# EAGLE design Color-lcd-backpack-v1.1 (EAGLE 5.10)
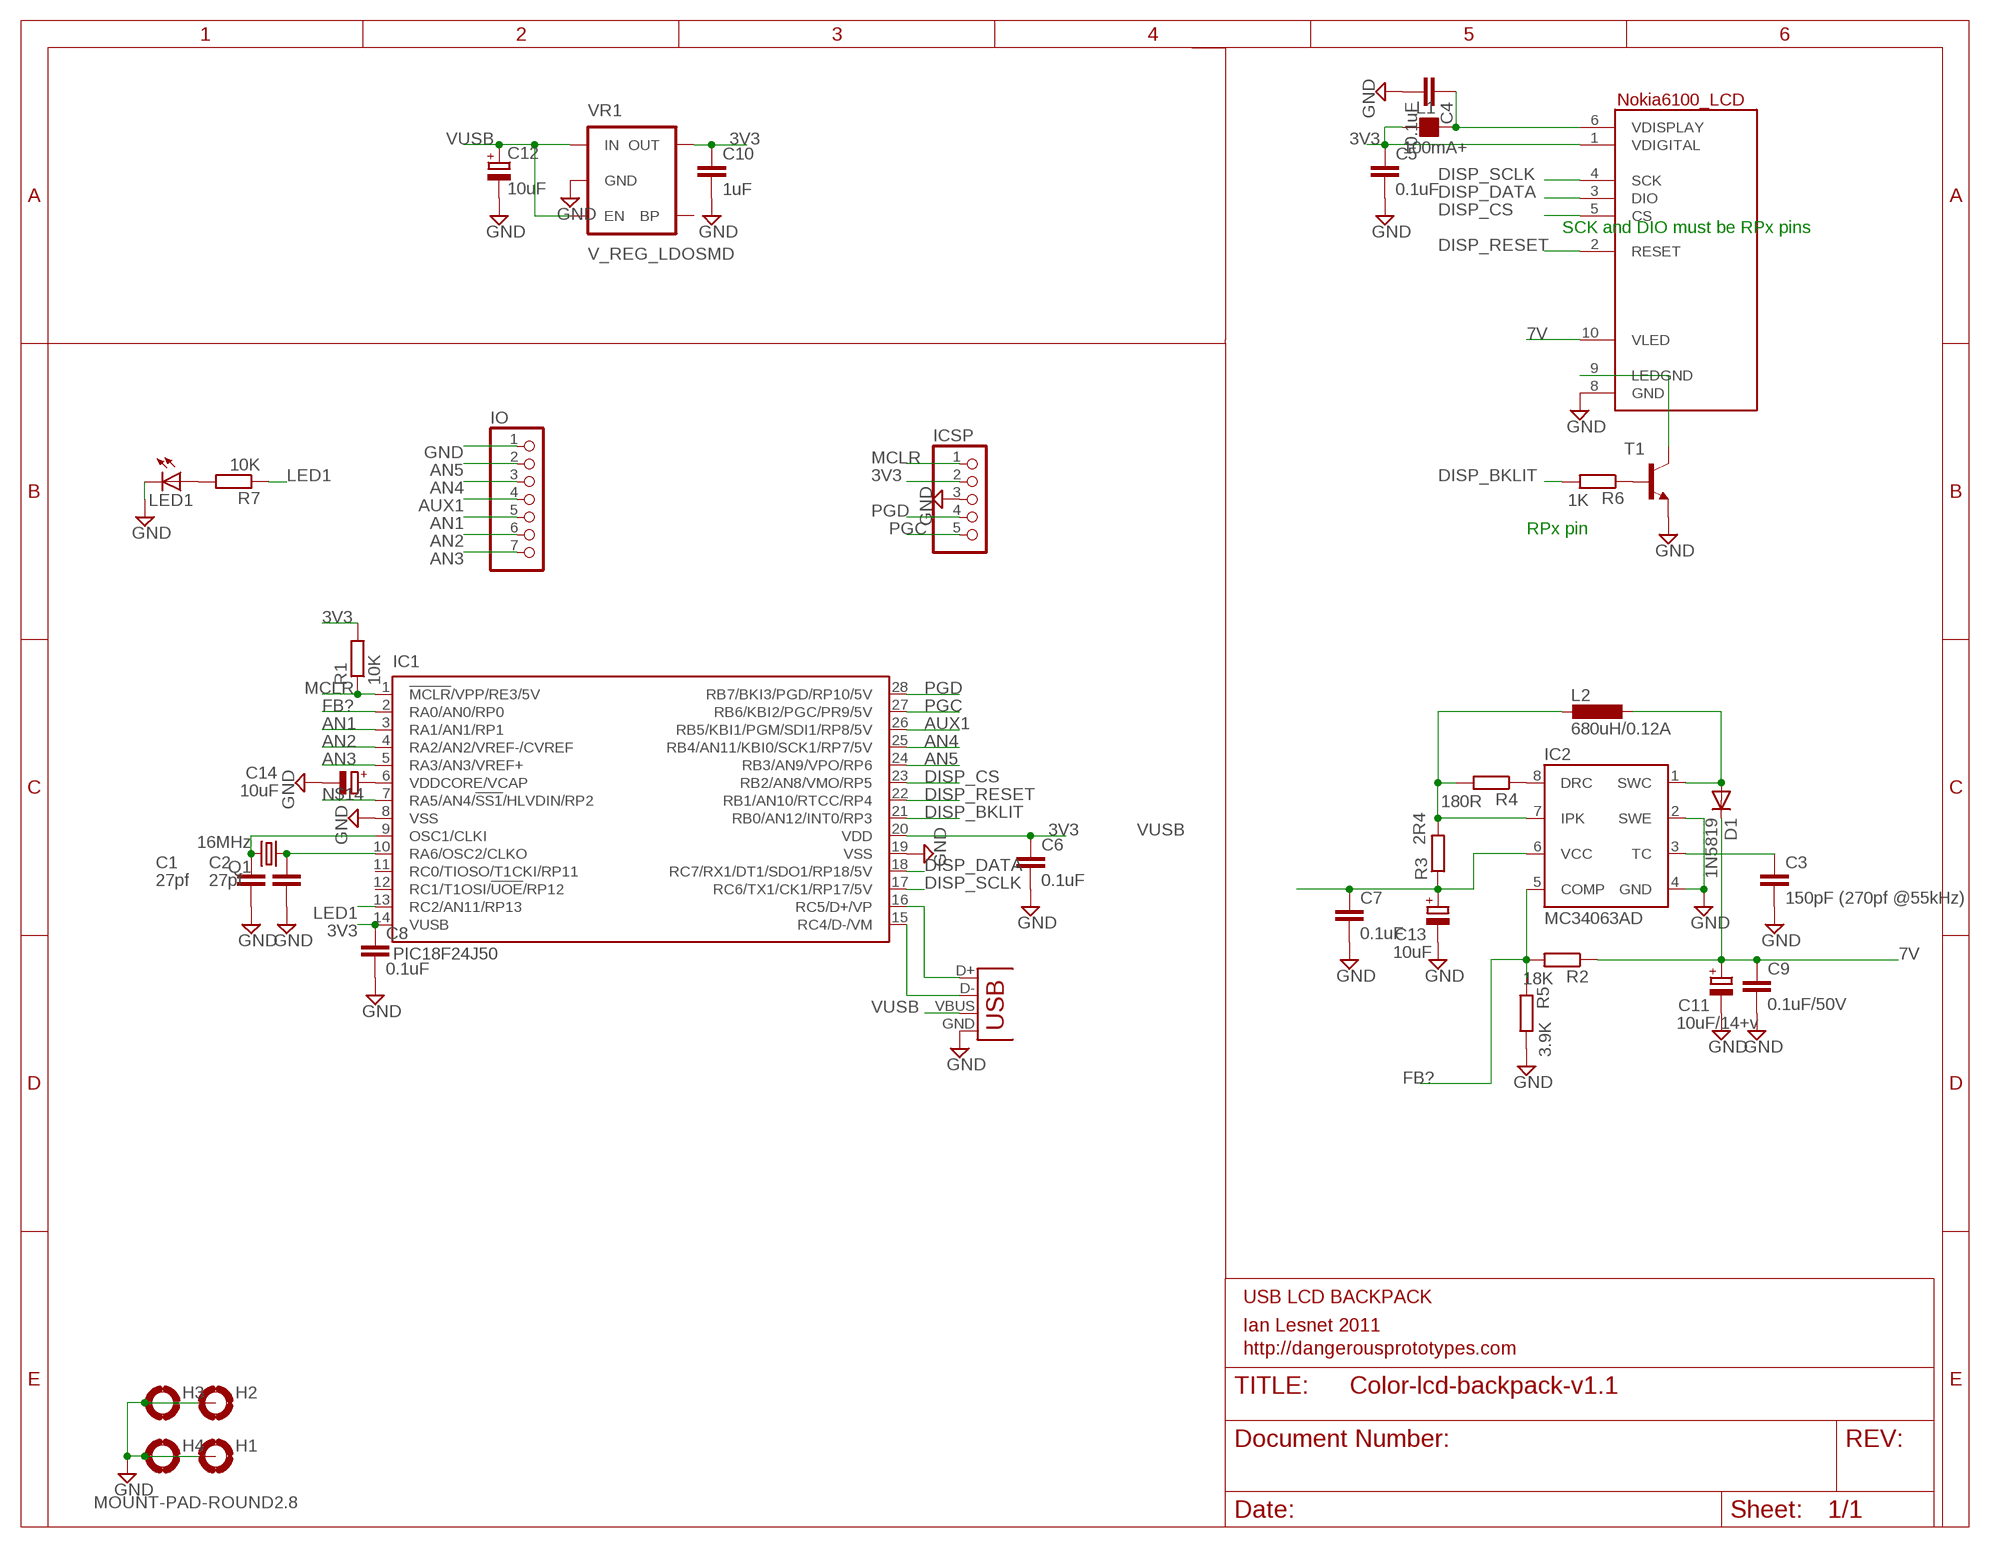
[diagram p0: schematic, sheet 1]

## Parts
C1  27pf  C-EUC0805  [C0805]
C2  27pf  C-EUC0805  [C0805]
C3  150pF (270pf @55kHz)  C-EUC0805K  [C0805K]
C4  0.1uF  C-EUC0805  [C0805]
C5  0.1uF  C-EUC0805  [C0805]
C6  0.1uF  C-EUC0805  [C0805]
C7  0.1uF  C-EUC0805K  [C0805K]
C8  0.1uF  C-EUC0805  [C0805]
C9  0.1uF/50V  C-EUC0805K  [C0805K]
C10  1uF  C-EUC0805  [C0805]
C11  10uF/14+v  CPOL-EUSANYO_SMD_A5  [SANYO-OSCON_SMD_A5]
C12  10uF  CPOL-EUSMCA  [SMC_A]
C13  10uF  CPOL-EUSMCA  [SMC_A]
C14  10uF  CPOL-EUSMCA  [SMC_A]
D1  1N5819  MBR0520LT  [SOD123]
H1  MOUNT-PAD-ROUND2.8  [2,8-PAD]
H2  MOUNT-PAD-ROUND2.8  [2,8-PAD]
H3  MOUNT-PAD-ROUND2.8  [2,8-PAD]
H4  MOUNT-PAD-ROUND2.8  [2,8-PAD]
IC1  PIC18F24J50  PIC18FJ2X50SSOP  [SSOP28]
IC2  MC34063AD  [SO08]
ICSP  PINHD-1X5  [1X05]
IO  PINHD-1X07_2.54-S  [1X07-S]
L1  100mA+  FB_0805  [L0805]
L2  680uH/0.12A  L-EUL4532P  [L4532P]
LCD1  NOKIA6100_LCD  [NOKIA6100_LCD]
LED1  LEDCHIPLED_0805  [CHIPLED_0805]
Q1  16MHz  CRYSTALHC49UP  [HC49UP]
R1  10K  R-EU_M0805  [M0805]
R2  18K  R-EU_M0805  [M0805]
R3  2R4  R-EU_M0805  [M0805]
R4  180R  R-EU_M0805  [M0805]
R5  3.9K  R-EU_M0805  [M0805]
R6  1K  R-EU_M0805  [M0805]
R7  10K  R-EU_M0805  [M0805]
T1  NPNSOT23BEC  [SOT23-BEC]
USB  USBSMD  [USB-MINIB]
VR1  V_REG_LDOSMD  [SOT23-5]

## Nets
3V3: C5.1 C6.1 C8.1 C10.1 IC1.14(VUSB) IC1.20(VDD) ICSP.2 L1.1 LCD1.1(VDIGITAL) R1.2 VR1.5(OUT)
7V: C9.1 C11.+ D1.C LCD1.10(VLED) R2.1
AN1: IC1.3(RA1/AN1/RP1) IO.5
AN2: IC1.4(RA2/AN2/VREF-/CVREF) IO.6
AN3: IC1.5(RA3/AN3/VREF+) IO.7
AN4: IC1.25(RB4/AN11/KBI0/SCK1/RP7/5V) IO.3
AN5: IC1.24(RB3/AN9/VPO/RP6) IO.2
AUX1: IC1.26(RB5/KBI1/PGM/SDI1/RP8/5V) IO.4
DISP_BKLIT: IC1.21(RB0/AN12/INT0/RP3) R6.2
DISP_CS: IC1.23(RB2/AN8/VMO/RP5) LCD1.5(CS)
DISP_DATA: IC1.18(RC7/RX1/DT1/SDO1/RP18/5V) LCD1.3(DIO)
DISP_RESET: IC1.22(RB1/AN10/RTCC/RP4) LCD1.2(RESET)
DISP_SCLK: IC1.17(RC6/TX1/CK1/RP17/5V) LCD1.4(SCK)
FB?: IC1.2(RA0/AN0/RP0) IC2.5(COMP) R2.2 R5.1
GND: C1.2 C2.2 C3.2 C4.2 C5.2 C6.2 C7.2 C8.2 C9.2 C10.2 C11.- C12.- C13.- C14.- H1.B2,8(MOUNT) H2.B2,8(MOUNT) H3.B2,8(MOUNT) H4.B2,8(MOUNT) IC1.8(VSS) IC1.19(VSS) IC2.2(SWE) IC2.4(GND) ICSP.3 IO.1 LCD1.8(GND) LED1.C R5.2 T1.E USB.GND VR1.2(GND)
LED1: IC1.13(RC2/AN11/RP13) R7.1
MCLR: IC1.1(!MCLR!/VPP/RE3/5V) ICSP.1 R1.1
N$1: LCD1.9(LEDGND) T1.C
N$2: C4.1 L1.2 LCD1.6(VDISPLAY)
N$3: R6.1 T1.B
N$4: C1.1 IC1.9(OSC1/CLKI) Q1.2
N$5: C2.1 IC1.10(RA6/OSC2/CLKO) Q1.1
N$6: C14.+ IC1.6(VDDCORE/VCAP)
N$7: IC1.16(RC5/D+/VP) USB.D+
N$8: IC1.15(RC4/D-/VM) USB.D-
N$9: IC2.8(DRC) R4.1
N$10: LED1.A R7.2
N$11: IC2.7(IPK) L2.2 R3.2 R4.2
N$14: IC1.7(RA5/AN4/!SS1!/HLVDIN/RP2)
N$17: D1.A IC2.1(SWC) L2.1
N$19: C3.1 IC2.3(TC)
PGC: IC1.27(RB6/KBI2/PGC/PR9/5V) ICSP.5
PGD: IC1.28(RB7/BKI3/PGD/RP10/5V) ICSP.4
VUSB: C7.1 C12.+ C13.+ IC2.6(VCC) R3.1 USB.VBUS VR1.1(IN) VR1.3(EN)
Unconnected: IC1.11(RC0/TIOSO/T1CKI/RP11) IC1.12(RC1/T1OSI/!UOE!/RP12) VR1.4(BP)

## Notes on the sheet
- SCK and DIO must be RPx pins
- RPx pin
- USB LCD BACKPACK
- Ian Lesnet 2011
- http://dangerousprototypes.com

## Library data of the parts
C1 C2 C4-C6 C8 C10 = resistor:C-EU: CAPACITOR, European symbol
C3 C7 C9 = rcl:C-EU: CAPACITOR, European symbol
C11-C14 = rcl:CPOL-EU: POLARIZED CAPACITOR, European symbol
D1 = diode:MBR0520LT: SCHOTTKY BARRIER RECTIFIER Source: http://onsemi.com .. MBR0520LT1-D.pdf
H1-H4 = holes:MOUNT-PAD-ROUND: MOUNTING PAD, round
IC1 = dp_devices:PIC18FJ2X50; PIC18FJ2X50: PIC18FJ2X50
IC2 = v-reg-3:MC34063A: 1.5A Step-Up/Down/Inverting Switching Regulator NPN Darlington Switch, Vin 3V to 40V, Current Limiter Input, adjustable Frequency up to 100kHz
ICSP = pinhead-2:PINHD-1X5: PIN HEADER
IO = pinhead-2:PINHD-1X07: PIN HEADER
L1 = rc-master:FB_: FERRITE BEAD
L2 = rcl:L-EU: INDUCTOR, European symbol
LCD1 = SparkFun:NOKIA6100_LCD: Nokia 6100 Color LCD Schematic element and footprint production proven but could use some touching up. Spark Fun Electronics SKU : LCD-00569. Mating SMD connector : LCD-00570
LED1 = led:LED: LED OSRAM: - CHIPLED LG R971, LG N971, LY N971, LG Q971, LY Q971, LO R971, LY R971 LH N974, LH R974 LS Q976, LO Q976, LY Q976 LO Q996 - Hyper CHIPLED LW Q18S LB Q993, LB Q99A, LB R99A - SideLED LS A670, LO A670, LY A670, LG A670, LP A670 LB A673, LV A673, LT A673, LW A673 LH A674 LY A675 LS A676, LA A676, LO A676, LY A676, LW A676 LS A679, LY A679, LG A679 - Hyper Micro SIDELED® LS Y876, LA Y876, LO Y876, LY Y876 LT Y87S - SmartLED LW L88C, LW L88S LB L89C, LB L89S, LG L890 LS L89K, LO L89K, LY L89K LS L896, LA L896, LO L896, LY L896 - TOPLED LS T670, LO T670, LY T670, LG T670, LP T670 LSG T670, LSP T670, LSY T670, LOP T670, LYG T670 LG T671, LOG T671, LSG T671 LB T673, LV T673, LT T673, LW T673 LH T674 LS T676, LA T676, LO T676, LY T676, LB T676, LH T676, LSB T676, LW T676 LB T67C, LV T67C, LT T67C, LS T67K, LO T67K, LY T67K, LW E67C LS E67B, LA E67B, LO E67B, LY E67B, LB E67C, LV E67C, LT E67C LW T67C LS T679, LY T679, LG T679 LS T770, LO T770, LY T770, LG T770, LP T770 LB T773, LV T773, LT T773, LW T773 LH T774 LS E675, LA E675, LY E675, LS T675 LS T776, LA T776, LO T776, LY T776, LB T776 LHGB T686 LT T68C, LB T68C - Hyper Mini TOPLED® LB M676 - Mini TOPLED Santana® LG M470 LS M47K, LO M47K, LY M47K Source: http://www.osram.convergy.de LUXEON: - LUMILED® LXK2-PW12-R00, LXK2-PW12-S00, LXK2-PW14-U00, LXK2-PW14-V00 LXK2-PM12-R00, LXK2-PM12-S00, LXK2-PM14-U00 LXK2-PE12-Q00, LXK2-PE12-R00, LXK2-PE12-S00, LXK2-PE14-T00, LXK2-PE14-U00 LXK2-PB12-K00, LXK2-PB12-L00, LXK2-PB12-M00, LXK2-PB14-N00, LXK2-PB14-P00, LXK2-PB14-Q00 LXK2-PR12-L00, LXK2-PR12-M00, LXK2-PR14-Q00, LXK2-PR14-R00 LXK2-PD12-Q00, LXK2-PD12-R00, LXK2-PD12-S00 LXK2-PH12-R00, LXK2-PH12-S00 LXK2-PL12-P00, LXK2-PL12-Q00, LXK2-PL12-R00 Source: www.luxeon.com KINGBRIGHT: KA-3528ASYC Source: www.kingbright.com
Q1 = crystal:CRYSTAL: CRYSTAL
R1 R7 = resistor:R-EU_: RESISTOR, European symbol
R2-R6 = rcl:R-EU_: RESISTOR, European symbol
T1 = dp_devices:NPN: Most commonly used is SOT23-BEC
USB = SparkFun:USB: USB Connectors USB-B-PTH is fully proven SKU : PRT-00139 USB-miniB is fully proven SKU : PRT-00587 USB-A-PCB is untested. USB-A-H is throughly reviewed, but untested. Spark Fun Electronics SKU : PRT-00437 USB-B-SMT is throughly reviewed, but untested. Needs silkscreen touching up. USB-A-S has not been used/tested USB-MB-H has not been used/tested
VR1 = SparkFun:V_REG_LDO: Voltage Regulator LDO Standard 150mA LDO voltage regulator in SOT-23 layout. Micrel part MIC5205. BP (by-pass) pin is used to lower output noise with 470pF cap.

## Board
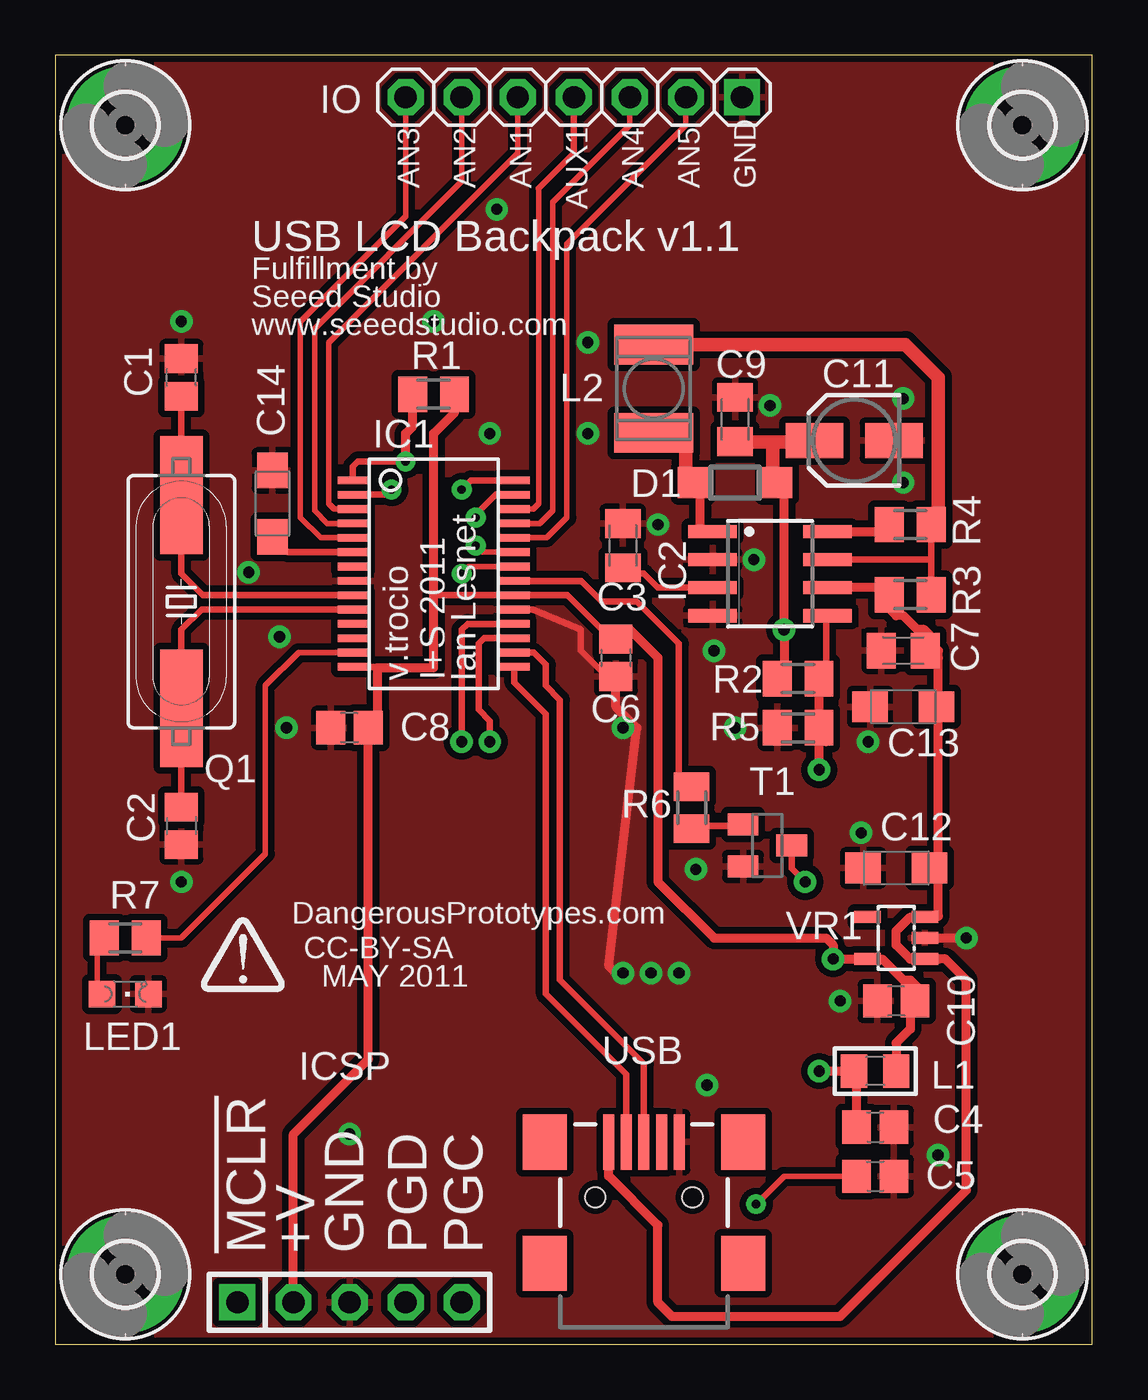
[diagram p1: board, top side]
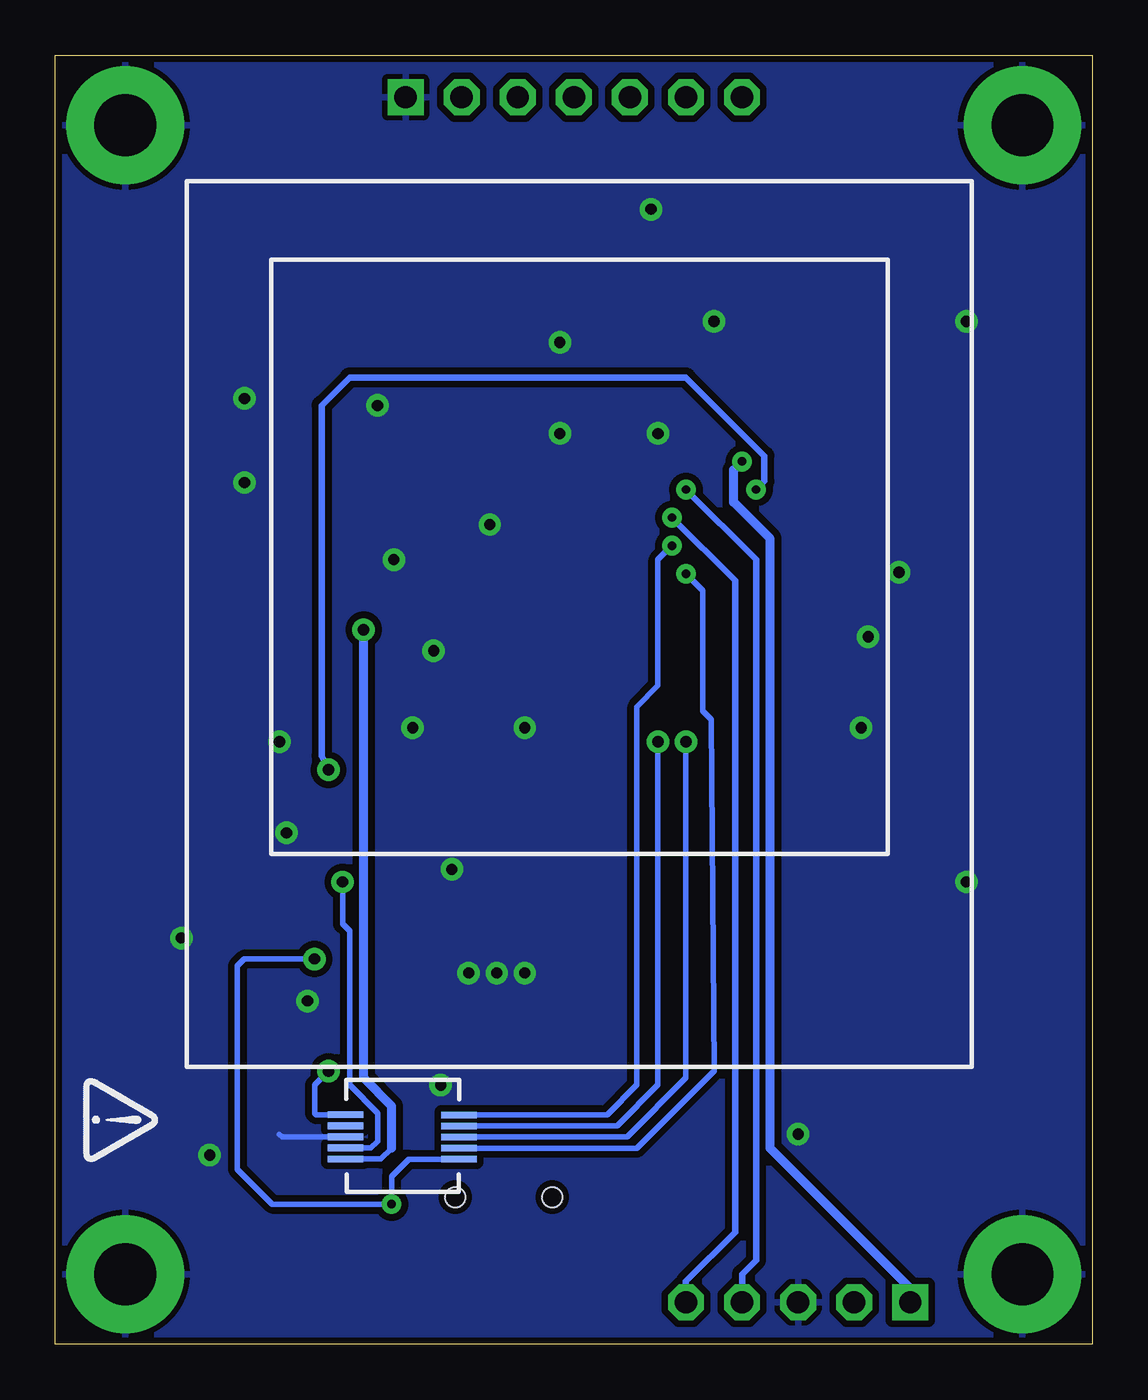
[diagram p2: board, bottom side, seen from below]

Size 46.99 x 58.42 mm. Coordinates in mm from the lower left corner, seen from the top.
Outline: 46.99,0 46.99,58.42 0,58.42 0,0 46.99,0
Copper layers (1*16): Top 0.035mm / dielectric 1.5mm / Bottom 0.035mm
Design rules "SparkFun": minimum track width 8mil, minimum drill 20mil, track to track 8mil, track to pad 8mil, pad to pad 8mil, via to via 8mil, smd to smd 8mil, copper to edge 10mil, drill to drill 8mil, minimum pad ring 12mil, minimum via ring 10mil, stop-mask expansion 4mil, vias tented up to drill 25mil, thermal gap 10mil

### Footprints (pad centres in the part's own frame; a part is rotated, then mirrored left to right if it is on the bottom)
C0805 = smd 1.3 x 1.5: 1 -0.85,0; 2 0.85,0
C0805K = smd 1.3 x 1.6: 1 -1,0; 2 1,0
SANYO-OSCON_SMD_A5 = smd 2.6 x 1.6: + 1.8,0; - -1.8,0
SMC_A = smd 1.6 x 1.4: + -1.5,0; - 1.5,0
SOD123 = smd 1.4 x 1.4: A 1.9,0; C -1.9,0
2,8-PAD = drill 2.8 pad 5.334 round: B2,8 0,0
SSOP28 = smd 0.348 x 1.397: 1 -4.225,-3.656; 2 -3.575,-3.656; 3 -2.925,-3.656; 4 -2.275,-3.656; 5 -1.625,-3.656; 6 -0.975,-3.656; 7 -0.325,-3.656; 8 0.325,-3.656; 9 0.975,-3.656; 10 1.625,-3.656; 11 2.275,-3.656; 12 2.925,-3.656; 13 3.575,-3.656; 14 4.225,-3.656; 15 4.225,3.656; 16 3.575,3.656; 17 2.925,3.656; 18 2.275,3.656; 19 1.625,3.656; 20 0.975,3.656; 21 0.325,3.656; 22 -0.325,3.656; 23 -0.975,3.656; 24 -1.625,3.656; 25 -2.275,3.656; 26 -2.925,3.656; 27 -3.575,3.656; 28 -4.225,3.656
SO08 = smd 0.6 x 2.2: 1 -1.905,-2.6; 2 -0.635,-2.6; 3 0.635,-2.6; 4 1.905,-2.6; 5 1.905,2.6; 6 0.635,2.6; 7 -0.635,2.6; 8 -1.905,2.6
1X05 = drill 1.016 square: 1 -5.08,0 | drill 1.016 octagon: 2 -2.54,0; 3 0,0; 4 2.54,0; 5 5.08,0
1X07-S = drill 1.016 square: 1 -7.62,0 | drill 1.016 octagon: 2 -5.08,0; 3 -2.54,0; 4 0,0; 5 2.54,0; 6 5.08,0; 7 7.62,0
L0805 = smd 1.2 x 1.5: 1 -0.953,0; 2 0.953,0
L4532P = smd 1.8 x 3.6: 1 -2,0; 2 2,0
NOKIA6100_LCD = smd 1.6 x 0.3: 1 24.255,44.311; 2 24.255,43.811; 3 24.255,43.311; 4 24.255,42.811; 5 24.255,42.311; 6 29.389,42.303; 7 29.389,42.803; 8 29.389,43.303; 9 29.389,43.803; 10 29.389,44.303
CHIPLED_0805 = smd 1.2 x 1.2: A 0,-1.05; C 0,1.05
HC49UP = smd 5.334 x 1.93: 1 -4.826,0; 2 4.826,0
M0805 = smd 1.3 x 1.6: 1 -0.95,0; 2 0.95,0
SOT23-BEC = smd 1 x 1.4: B -0.95,-1.1; C 0,1.1; E 0.95,-1.1
USB-MINIB = smd 2.5 x 0.5: D+ 2.5,0; D- 2.5,0.8; GND 2.5,-1.6; ID 2.5,-0.8; VBUS 2.5,1.6 | smd 2.5 x 2: GND@1 -3,-4.5; GND@2 -3,4.5; GND@3 2.5,4.5; GND@4 2.5,-4.5 | hole 0.9: 0,2.2; 0,-2.2
SOT23-5 = smd 0.55 x 1.2: 1 -0.95,-1.3; 2 0,-1.3; 3 0.95,-1.3; 4 0.95,1.3; 5 -0.95,1.3

### Placement (x,y rotation side)
C1  5.71,43.81 90 top
C2  5.71,23.49 270 top
C3  25.72,36.2 90 top
C4  37.15,9.84 0 top
C5  37.15,7.62 0 top
C6  25.4,31.12 270 top
C7  38.42,31.43 180 top
C8  13.34,27.94 180 top
C9  30.8,41.91 90 top
C10  38.1,15.56 180 top
C11  36.2,40.96 180 top
C12  38.1,21.59 180 top
C13  38.42,28.89 180 top
C14  9.84,38.1 90 top
D1  30.8,39.05 180 top
H1  43.81,3.17 0 top
H2  43.81,55.24 0 top
H3  3.18,55.24 0 top
H4  3.18,3.17 0 top
IC1  17.14,34.92 270 top
IC2  32.38,34.92 270 top
ICSP  13.34,1.91 0 top
IO  23.49,56.52 180 top
L1  37.15,12.38 180 top
L2  27.11,43.31 90 top
LCD1  4.45,52.7 180 bottom
LED1  3.18,15.88 270 top
Q1  5.71,33.66 90 top
R1  17.14,43.05 0 top
R2  33.66,30.16 0 top
R3  38.73,33.97 0 top
R4  38.73,37.15 0 top
R5  33.66,27.94 180 top
R6  28.83,24.32 90 top
R7  3.18,18.41 180 top
T1  32.26,22.61 270 top
U$1  [DP-LOGO_TOP]  6.59,15.96 0 top
U$2  [DP-LOGO-BOTTOM]  45.72,8.26 90 top
USB  26.67,6.67 90 top
VR1  38.1,18.41 90 top

### Tracks (layer width: path | path; a pad name or v marks a point on that pad's centre or on a via)
3V3  (via drill 0.38, 0.51)
  Top 0.254: C5.1 33.02,7.62 v31.75,6.35
  Top 0.305: 25.4,32.38 C6.1 | 25.08,32.38 24.77,32.38 23.2,33.95 IC1.20 17.15,33.95 17.14,33.96 | IC1.14 14.57,30.7 14.61,30.67
  Top 0.406: 25.08,32.38 25.4,32.07 25.4,32.38 26.03,32.38 27.3,31.12 27.3,20.95 29.84,18.41 34.92,18.41 35.24,18.1 v35.24,17.46 VR1.5 37.46,17.46 38.42,16.51 38.73,16.51 39.05,16.19 39.05,15.66 C10.1 | C10.1 38.73,15.77 | C10.1 38.73,15.56 38.73,14.29 38.1,13.65 L1.1 | R1.2 18.09,42.23 17.14,41.27 17.14,33.96 17.14,30.67 14.61,30.67 14.61,28.57 C8.1 14.18,12.92 10.79,9.53 ICSP.2
  Bottom 0.254: LCD1.1 30.98,8.39 31.75,7.62 v31.75,6.35 37.15,6.35 38.73,7.94 38.73,17.14 38.42,17.46 v35.24,17.46
7V  (via drill 0.51)
  Top 0.305: 33.02,30.16 R2.1 33.02,30.16
  Top 0.406: 33.02,30.16 | R2.1 33.02,30.48 v33.02,32.38 33.02,39 32.97,39.05 | 32.97,39.05 D1.C | 30.84,40.89 C9.1 | 32.97,39.05 32.51,39.1 | C11.+ 34.29,40.96 33.97,40.89
  Top 0.61: 32.51,40.89 30.84,40.89 | 32.51,39.1 32.51,40.89 | 32.51,40.89 33.97,40.89
  Bottom 0.254: LCD1.10 32.24,8.4 31.75,8.89
  Bottom 0.406: 31.75,8.89 31.75,10.79 33.02,12.07 v33.02,32.38
AN1
  Top 0.254: IC1.3 12.63,37.85 12.38,38.1 12.38,45.4 20.95,53.98 IO.5
AN2
  Top 0.254: IC1.4 12.33,37.2 11.75,37.78 11.75,46.04 18.41,52.7 IO.6
AN3
  Top 0.254: IC1.5 12.03,36.55 11.11,37.46 11.11,46.35 15.88,51.12 IO.7
AN4
  Top 0.254: IC1.25 21.96,37.2 22.54,37.78 22.54,51.75 26.03,55.24 IO.3
AN5
  Top 0.254: IC1.24 22.26,36.55 23.18,37.46 23.18,49.85 28.57,55.24 IO.2
AUX1
  Top 0.254: IC1.26 21.66,37.85 21.91,38.1 21.91,52.39
  Top 0.305: 21.91,52.39 23.49,53.98 IO.4
DISP_BKLIT
  Top 0.305: IC1.21 23.82,34.6 24.77,33.66 26.35,33.66 28.26,31.75 28.26,25.84 R6.2 28.89,25.4 28.57,25.4
DISP_CS  (via drill 0.38)
  Top 0.254: IC1.23 19.34,35.9 v19.05,36.2
  Bottom 0.254: LCD1.5 21.99,10.39 20.64,11.75 20.64,28.89 19.69,29.84 19.69,35.56 v19.05,36.2
DISP_DATA  (via drill 0.51)
  Top 0.305: IC1.18 18.68,32.65 18.41,32.38 v18.41,27.3
  Bottom 0.254: LCD1.3 21.09,9.39 18.41,12.07 v18.41,27.3
DISP_RESET  (via drill 0.38)
  Top 0.254: IC1.22 18.74,35.25 v18.41,34.92
  Bottom 0.254: LCD1.2 20.64,8.89 17.14,12.38 17.27,28.32 17.65,28.7 17.65,34.16 v18.41,34.92
DISP_SCLK  (via drill 0.51)
  Top 0.305: v19.69,27.3 19.69,28.26 19.18,28.77 19.18,31.75 19.43,32 IC1.17
  Bottom 0.254: LCD1.4 21.54,9.89 19.69,11.75 v19.69,27.3
FB?  (via drill 0.38, 0.51)
  Top 0.305: IC2.5 34.92,33.02 34.92,30.48 R2.2 34.92,30.16 | IC1.2 15,38.5 v15.24,38.73
  Top 0.406: R5.1 34.6,27.62 34.92,27.3 | R5.1 R2.2 | R5.1 34.6,26.99 v34.61,26.04
  Bottom 0.305: v15.24,38.73 14.86,39.12 14.86,40.26 18.41,43.81 33.66,43.81 34.92,42.55 34.92,26.67 v34.61,26.04
GND  (via drill 0.51)
  Top 0.305: IC1.19 21.63,33.3 23.81,32.38 23.81,31.43 24.77,30.48 25.19,30.48 C6.2 | 25.3,30.16 25.3,30.38 25.4,30.48
  Top 0.406: 25.3,30.16 C6.2 25.4,28.89 26.35,27.94 25.08,17.14 25.73,16.5 | VR1.2 v41.27,18.41
  Bottom 0.254: LCD1.8 36.71,9.4 36.83,9.53
  other vias: 24.13,45.4 13.34,9.53 25.72,27.94 27.3,37.15 29.84,31.43 36.83,27.3 31.65,35.56 5.71,20.95 5.71,46.35 25.72,16.83 29.53,11.75 35.56,15.56 39.99,8.57 30.8,27.94 29.02,21.53 36.51,23.18 26.99,16.83 28.26,16.83 10.48,27.94 32.38,42.55 38.42,39.05 8.76,34.99 38.42,42.86 24.13,41.27 20,51.44 17.14,46.35 19.69,41.27 10.16,32.07
  pour Top (isolate 0.305): 0,0 0,58.42 46.99,58.42 46.99,0
  pour Bottom (isolate 0.305): 0,0 0,58.42 46.99,58.42 46.99,0
LED1
  Top 0.254: R7.1 5.71,18.41 9.52,22.22 9.52,29.84 11.03,31.35 IC1.13
MCLR  (via drill 0.38)
  Top 0.305: IC1.1 13.49,39.78 13.72,40 v15.88,40
  Top 0.406: v15.88,40 15.88,41.27 16.2,41.59 R1.1
  Bottom 0.406: v15.88,40 16.26,39.62 16.26,38.16 14.61,36.51 14.61,8.89 8.25,2.54 ICSP.1
N$1  (via drill 0.51)
  Top 0.305: T1.C 33.36,21.57 v33.97,20.95
  Bottom 0.254: 33.96,8.9 LCD1.9 32.69,8.9 32.38,9.21 32.38,10.48 33.66,11.75 33.66,18.73 33.97,19.05 v33.97,20.95
N$2  (via drill 0.51)
  Top 0.406: C4.1 36.3,11.96 L1.2 v34.61,12.38
  Bottom 0.254: LCD1.6 35.17,10.4 35.24,10.48 35.24,11.75 v34.61,12.38
N$3
  Top 0.305: T1.B 31.12,23.56 31.12,23.49 28.83,23.49 R6.1
N$4
  Top 0.305: C1.1 Q1.2 5.71,34.92 6.69,33.95 IC1.9
N$5
  Top 0.305: C2.1 Q1.1 5.71,32.38 6.63,33.3 IC1.10
N$6
  Top 0.305: IC1.6 10.54,35.9 C14.+
N$7
  Top 0.305: IC1.16 21.67,31.35 22.23,30.8 22.23,29.84 22.86,29.21 22.86,16.51 26.67,12.7 USB.D+
N$8
  Top 0.305: IC1.15 20.8,30 22.23,28.57 22.23,15.88 25.87,12.23 USB.D-
N$9
  Top 0.406: IC2.8 37.78,36.83 R4.1
N$10
  Top 0.254: R7.2 1.9,18.41 1.9,16.09 LED1.A
N$11
  Top 0.305: 39.69,35.56 IC2.7 | 39.69,35.56 R3.2 | R4.2 39.69,35.56
  Top 0.61: L2.2 38.51,45.31 40.01,43.81 40.01,37.47 R4.2
N$17
  Top 0.406: IC2.1 29.21,36.83 29.21,38.74 D1.A 29.21,39.37
  Top 0.61: L2.1 28.54,41.31 28.57,41.27 28.57,39.38 D1.A
N$19
  Top 0.305: IC2.3 27.3,34.29 26.67,34.92 25.99,34.92 C3.1
PGC  (via drill 0.38)
  Top 0.305: IC1.27 19.96,38.5 19.05,37.59 v19.05,37.46
  Bottom 0.305: v19.05,37.46 16.19,34.61 16.19,5.08 18.41,2.86 ICSP.5
PGD  (via drill 0.38)
  Top 0.305: IC1.28 18.83,39.15 v18.41,38.73
  Bottom 0.305: v18.41,38.73 15.24,35.56 15.24,3.81 15.88,3.17 ICSP.4
VUSB
  Top 0.305: R3.1 | C7.1 40.01,31.12
  Top 0.406: IC2.6 37.78,34.29 R3.1 37.46,33.97 37.46,33.66 37.78,33.66 37.78,33.34 38.1,33.02 38.42,33.02 39.05,32.38 39.37,32.38 39.69,32.07 39.64,32.07 39.37,31.8 C7.1 40.01,31.43 40.01,29.12 C13.+ 40.01,28.89 40.01,21.82 C12.+ 40.01,21.59 40.01,19.39 VR1.3 38.73,19.37 38.1,18.73 38.1,18.1 38.73,17.46 VR1.1 | 40.01,31.12 39.77,31.12 | VR1.1 40.04,17.46 | VR1.1 40.32,17.46 41.27,16.51 41.27,6.99 35.56,1.27 27.94,1.27 27.3,1.91 27.3,5.4 25.07,7.63 USB.VBUS

### Text on the board
tPlace: AN3 | AN2 | AN1 | AN4 | AN5 | GND | AUX1 | v.trocio | !MCLR | +V | GND | PGD | PGC
tNames: USB LCD Backpack v1.1 | Fulfillment by | Seeed Studio | www.seeedstudio.com | I+S 2011 | Ian Lesnet | DangerousPrototypes.com | CC-BY-SA | MAY 2011
Reference: IO | AN3 | AN2 | AN1 | AUX1 | AN4 | AN5 | GND | !MCLR | +V | GND | PGD | PGC | USB | ICSP